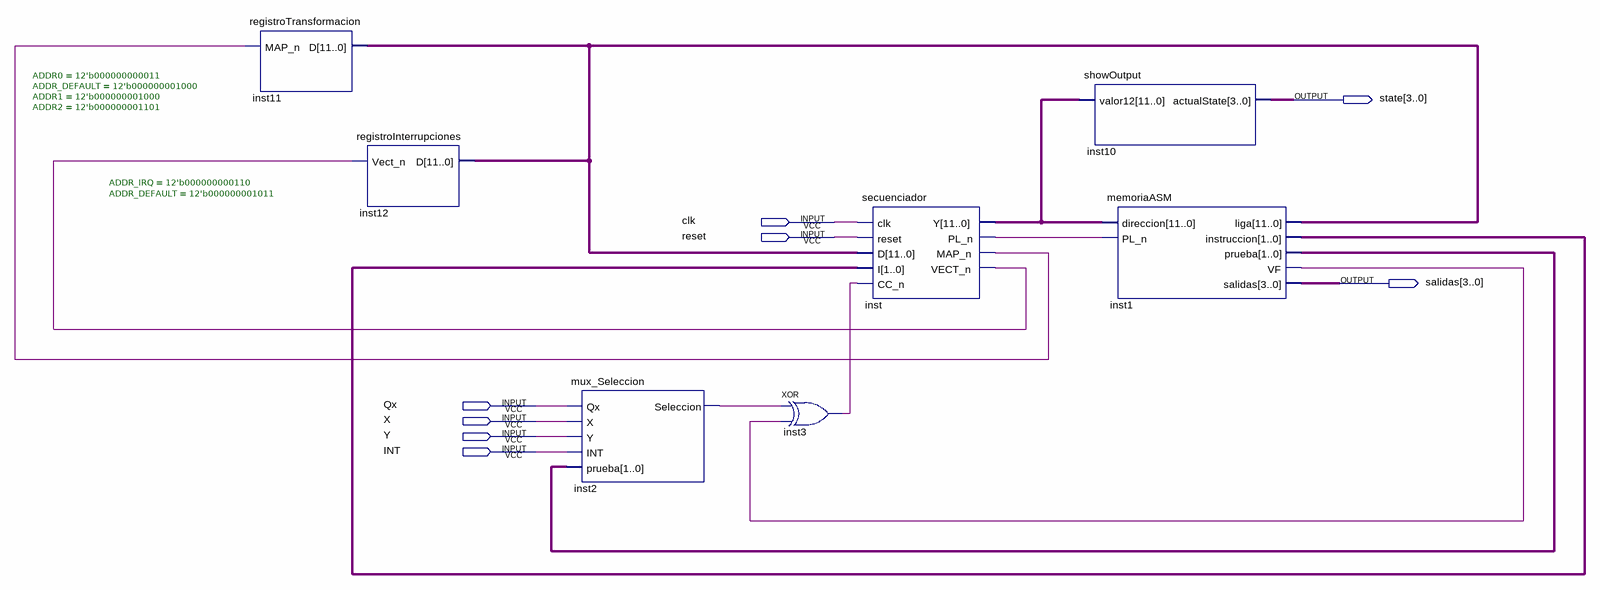
[diagram p0: schematic sheet]
// Quartus schematic practica4.bdf as structural Verilog: 7 symbols, 8 pins
module practica4 (
  input  clk,
  input  reset,
  input  Qx,
  input  X,
  input  Y,
  input  INT,
  output [3:0] state,
  output [3:0] salidas
);

  wire inst1_vf, inst2_seleccion, inst3_out, inst_map_n, inst_pl_n, inst_vect_n;
  wire [1:0] inst1_instruccion, inst1_prueba;
  wire [11:0] inst11_d, inst_y;

  registroTransformacion #(.ADDR0(12'b000000000011), .ADDR_DEFAULT(12'b000000001000), .ADDR1(12'b000000001000), .ADDR2(12'b000000001101)) inst11 (
    .MAP_n(inst_map_n), .D(inst11_d));
  registroInterrupciones #(.ADDR_IRQ(12'b000000000110), .ADDR_DEFAULT(12'b000000001011)) inst12 (
    .Vect_n(inst_vect_n), .D(inst11_d));
  mux_Seleccion inst2 (.Qx(Qx), .X(X), .Y(Y), .INT(INT), .prueba(inst1_prueba), .Seleccion(inst2_seleccion));
  xor inst3 (inst3_out, inst2_seleccion, inst1_vf);
  secuenciador inst (
    .clk(clk), .reset(reset), .D(inst11_d), .I(inst1_instruccion), .CC_n(inst3_out), .Y(inst_y),
    .PL_n(inst_pl_n), .MAP_n(inst_map_n), .VECT_n(inst_vect_n));
  showOutput inst10 (.valor12(inst_y), .actualState(state));
  memoriaASM inst1 (
    .direccion(inst_y), .PL_n(inst_pl_n), .liga(inst11_d), .instruccion(inst1_instruccion),
    .prueba(inst1_prueba), .VF(inst1_vf), .salidas(salidas));
endmodule
